# Altium project Thunderscope_Rev1.PrjPCB (part 2 of 2)

## Sheet CON_PCIe_X4.SchDoc: ThunderScope 1000E
size A4; DrawnBy: Aleksa Bjelogrlic; Revision: 1
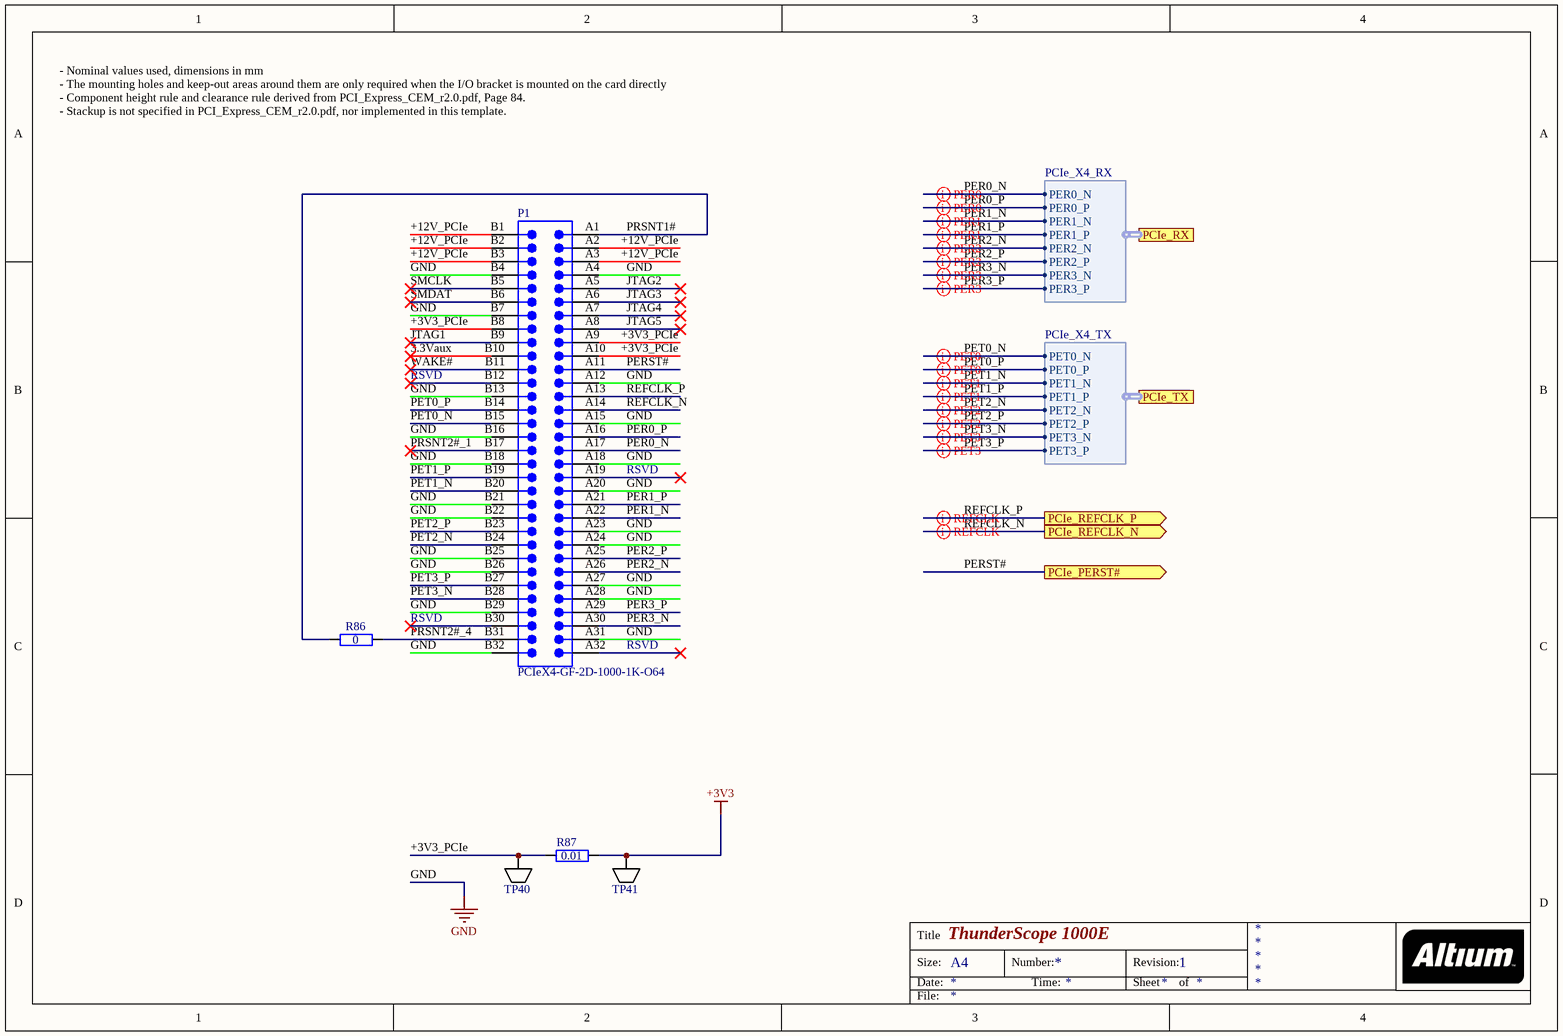
[diagram p6: CON_PCIe_X4.SchDoc]

### Parts
P1  PCIeX4-GF-2D-1000-1K-O64  [PCIeX4-GF-2D-1000-1K-O64]  (no BOM)
R86  0  [GEN_R_0402]
R87  0.01  [GEN_R_0603]
TP40  5015  [KEY_5015]  (value not drawn)
TP41  5015  [KEY_5015]  (value not drawn)

### Ports
PCIe_PERST# (out), PCIe_REFCLK_N (out), PCIe_REFCLK_P (out), PCIe_RX (harness PCIe_X4_RX), PCIe_TX (harness PCIe_X4_TX)

### Harnesses
PCIe_X4_RX: PER0_N, PER0_P, PER1_N, PER1_P, PER2_N, PER2_P, PER3_N, PER3_P
PCIe_X4_TX: PET0_N, PET0_P, PET1_N, PET1_P, PET2_N, PET2_P, PET3_N, PET3_P

### Nets
+3V3: R87.2 TP41.1
GND: P1.A4 P1.A12 P1.A15 P1.A18 P1.A20 P1.A23 P1.A24 P1.A27 P1.A28 P1.A31 P1.B4 P1.B7 P1.B13 P1.B16 P1.B18 P1.B21 P1.B22 P1.B25 P1.B26 P1.B29 P1.B32
3.3Vaux: P1.B10
+3V3_PCIe: P1.A9 P1.A10 P1.B8 R87.1 TP40.1
+12V_PCIe: P1.A2 P1.A3 P1.B1 P1.B2 P1.B3
JTAG1: P1.B9
JTAG2: P1.A5
JTAG3: P1.A6
JTAG4: P1.A7
JTAG5: P1.A8
PER0_N: P1.A17 ; port PCIe_RX.PER0_N  [project net PCIe_PER0_N]
PER0_P: P1.A16 ; port PCIe_RX.PER0_P  [project net PCIe_PER0_P]
PER1_N: P1.A22 ; port PCIe_RX.PER1_N  [project net PCIe_PER1_N]
PER1_P: P1.A21 ; port PCIe_RX.PER1_P  [project net PCIe_PER1_P]
PER2_N: P1.A26 ; port PCIe_RX.PER2_N  [project net PCIe_PER2_N]
PER2_P: P1.A25 ; port PCIe_RX.PER2_P  [project net PCIe_PER2_P]
PER3_N: P1.A30 ; port PCIe_RX.PER3_N  [project net PCIe_PER3_N]
PER3_P: P1.A29 ; port PCIe_RX.PER3_P  [project net PCIe_PER3_P]
PERST#: P1.A11 ; port PCIe_PERST#  [project net PCIe_PERST#]
PET0_N: P1.B15 ; port PCIe_TX.PET0_N  [project net PCIe_PET0_N]
PET0_P: P1.B14 ; port PCIe_TX.PET0_P  [project net PCIe_PET0_P]
PET1_N: P1.B20 ; port PCIe_TX.PET1_N  [project net PCIe_PET1_N]
PET1_P: P1.B19 ; port PCIe_TX.PET1_P  [project net PCIe_PET1_P]
PET2_N: P1.B24 ; port PCIe_TX.PET2_N  [project net PCIe_PET2_N]
PET2_P: P1.B23 ; port PCIe_TX.PET2_P  [project net PCIe_PET2_P]
PET3_N: P1.B28 ; port PCIe_TX.PET3_N  [project net PCIe_PET3_N]
PET3_P: P1.B27 ; port PCIe_TX.PET3_P  [project net PCIe_PET3_P]
PRSNT1#: P1.A1 R86.1
PRSNT2#_1: P1.B17
PRSNT2#_4: P1.B31 R86.2
REFCLK_N: P1.A14 ; port PCIe_REFCLK_N  [project net PCIe_REFCLK_N]
REFCLK_P: P1.A13 ; port PCIe_REFCLK_P  [project net PCIe_REFCLK_P]
SMCLK: P1.B5
SMDAT: P1.B6
WAKE#: P1.B11

Not connected (* = marked no-connect by the designer): P1 A19* A32* B12* B30*

### Layout directives
differential pair: PCIe_PER0_N, PCIe_PER0_P, PCIe_PER1_N, PCIe_PER1_P, PCIe_PER2_N, PCIe_PER2_P, PCIe_PER3_N, PCIe_PER3_P, PCIe_PET0_N, PCIe_PET0_P, PCIe_PET1_N, PCIe_PET1_P, PCIe_PET2_N, PCIe_PET2_P, PCIe_PET3_N, PCIe_PET3_P, PCIe_REFCLK_N, PCIe_REFCLK_P

### Notes on the sheet
- - Nominal values used, dimensions in mm
  - The mounting holes and keep-out areas around them are only required when the I/O bracket is mounted on the card directly
  - Component height rule and clearance rule derived from PCI_Express_CEM_r2.0.pdf, Page 84.
  - Stackup is not specified in PCI_Express_CEM_r2.0.pdf, nor implemented in this template.
- RSVD
- (near R86) RSVD
- Title
- Size:
- Date:
- A4
- Number:
- Time:
- Revision:
- Sheet
- of
- File:

### Library data of the parts
P1 = CMP-0001-00031-2: Golden finger, PCIeX4, Dual, Opposite, Pitch 1mm, 64-Position; Mating Connector: Molex-87715-9106; Datasheet Version: rev2.0, Apr-2007; Package Reference: PCIeX4-GF-2D-1000-1K-O64; ClassName: Edge Connector; Publisher: Altium
R86 = RES 0 OHM 1/16W 0402: Power Rating: 0.0625W; Package: 0402; Supplier 1: Digi-Key; Supplier Part Number 1: 311-0.0JRCT-ND; Value: 0
R87 = RES 0.01 OHM 1% 1/4W 0603: Tolerance: 1%; Power Rating: 0.25W; Supplier 1: Digi-Key; Supplier Part Number 1: 408-1404-1-ND; Value: 0.01; Package: 0603
TP40 TP41 = TP KEYSTONE 5015: Supplier 1: Digi-Key; Supplier Part Number 1: 36-5015CT-ND

## Sheet M2_KEY_M.SchDoc: ThunderScope 1000E
size A4
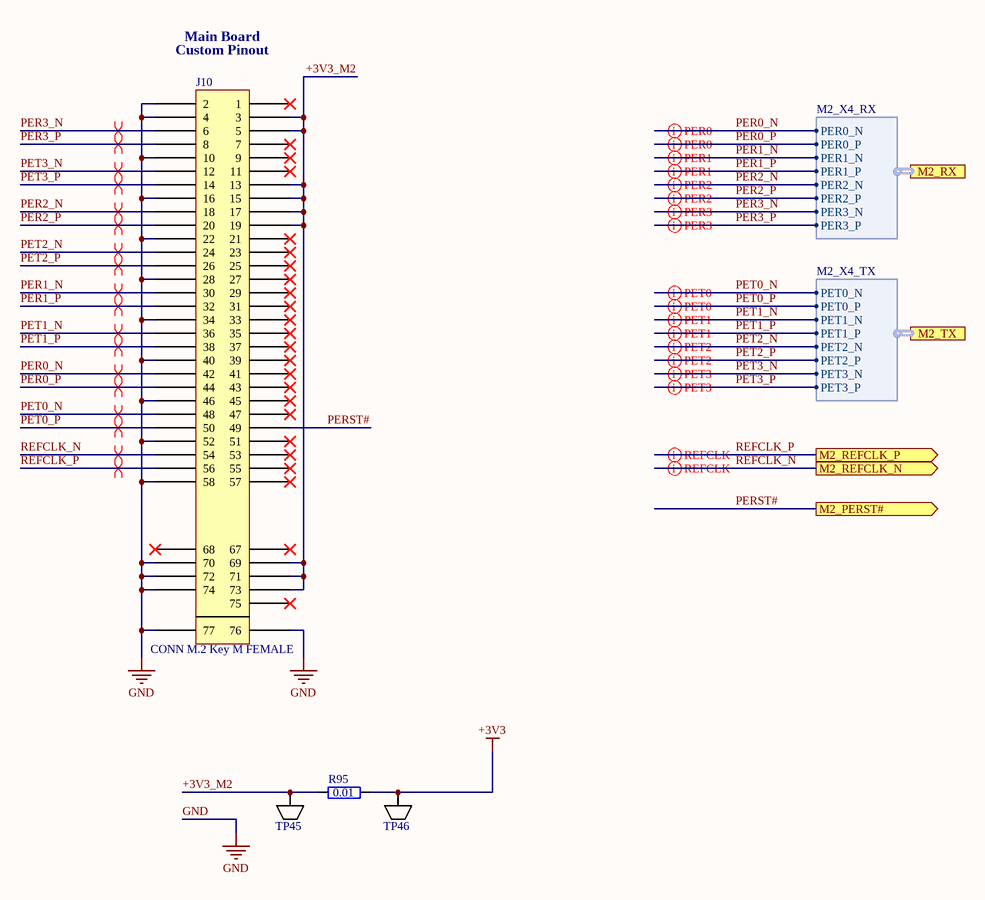
[diagram p7: M2_KEY_M.SchDoc]

### Parts
J10  CONN M.2 Key M FEMALE  [TE_M2_KEYM_2199230]
R95  0.01  [GEN_R_0603]
TP45  5015  [KEY_5015]  (value not drawn)
TP46  5015  [KEY_5015]  (value not drawn)

### Ports
M2_PERST# (out), M2_REFCLK_N (out), M2_REFCLK_P (out), M2_RX (harness M2_X4_RX), M2_TX (harness M2_X4_TX)

### Harnesses
M2_X4_RX: PER0_N, PER0_P, PER1_N, PER1_P, PER2_N, PER2_P, PER3_N, PER3_P
M2_X4_TX: PET0_N, PET0_P, PET1_N, PET1_P, PET2_N, PET2_P, PET3_N, PET3_P

### Nets
+3V3: R95.2 TP46.1
GND: J10.2 J10.4 J10.10 J10.16 J10.22 J10.28 J10.34 J10.40 J10.46 J10.52 J10.58 J10.70 J10.72 J10.74 J10.76 J10.77
+3V3_M2: J10.3 J10.5 J10.13 J10.15 J10.17 J10.19 J10.69 J10.71 J10.73 R95.1 TP45.1
PER0_N: J10.42 ; port M2_RX.PER0_N  [project net M2_PER0_N]
PER0_P: J10.44 ; port M2_RX.PER0_P  [project net M2_PER0_P]
PER1_N: J10.30 ; port M2_RX.PER1_N  [project net M2_PER1_N]
PER1_P: J10.32 ; port M2_RX.PER1_P  [project net M2_PER1_P]
PER2_N: J10.18 ; port M2_RX.PER2_N  [project net M2_PER2_N]
PER2_P: J10.20 ; port M2_RX.PER2_P  [project net M2_PER2_P]
PER3_N: J10.6 ; port M2_RX.PER3_N  [project net M2_PER3_N]
PER3_P: J10.8 ; port M2_RX.PER3_P  [project net M2_PER3_P]
PERST#: J10.49 ; port M2_PERST#  [project net M2_PERST#]
PET0_N: J10.48 ; port M2_TX.PET0_N  [project net M2_PET0_N]
PET0_P: J10.50 ; port M2_TX.PET0_P  [project net M2_PET0_P]
PET1_N: J10.36 ; port M2_TX.PET1_N  [project net M2_PET1_N]
PET1_P: J10.38 ; port M2_TX.PET1_P  [project net M2_PET1_P]
PET2_N: J10.24 ; port M2_TX.PET2_N  [project net M2_PET2_N]
PET2_P: J10.26 ; port M2_TX.PET2_P  [project net M2_PET2_P]
PET3_N: J10.12 ; port M2_TX.PET3_N  [project net M2_PET3_N]
PET3_P: J10.14 ; port M2_TX.PET3_P  [project net M2_PET3_P]
REFCLK_N: J10.54 ; port M2_REFCLK_N  [project net M2_REFCLK_N]
REFCLK_P: J10.56 ; port M2_REFCLK_P  [project net M2_REFCLK_P]

Not connected (* = marked no-connect by the designer): J10 1* 7* 9* 11* 21* 23* 25* 27* 29* 31* 33* 35* 37* 39* 41* 43* 45* 47* 51* 53* 55* 57* 67* 68* 75*

### Layout directives
differential pair: M2_PER0_N, M2_PER0_P, M2_PER1_N, M2_PER1_P, M2_PER2_N, M2_PER2_P, M2_PER3_N, M2_PER3_P, M2_PET0_N, M2_PET0_P, M2_PET1_N, M2_PET1_P, M2_PET2_N, M2_PET2_P, M2_PET3_N, M2_PET3_P, M2_REFCLK_N, M2_REFCLK_P
differential pair; differential pair class PCIe: M2_PER0_N, M2_PER0_P, M2_PER1_N, M2_PER1_P, M2_PER2_N, M2_PER2_P, M2_PER3_N, M2_PER3_P, M2_PET0_N, M2_PET0_P, M2_PET1_N, M2_PET1_P, M2_PET2_N, M2_PET2_P, M2_PET3_N, M2_PET3_P, M2_REFCLK_N, M2_REFCLK_P

### Notes on the sheet
- Main Board
- (near J10) Custom Pinout

### Library data of the parts
R95 = RES 0.01 OHM 1% 1/4W 0603: Tolerance: 1%; Power Rating: 0.25W; Supplier 1: Digi-Key; Supplier Part Number 1: 408-1404-1-ND; Value: 0.01; Package: 0603
TP45 TP46 = TP KEYSTONE 5015: Supplier 1: Digi-Key; Supplier Part Number 1: 36-5015CT-ND
J10 = CONN M.2 Key M FEMALE: Supplier 1: Digi-Key; Supplier Part Number 1: A124992CT-ND

## Nets that join several sheets
+1V8APLL: ADC (FB3.2), PLL (17 pins)
+1V8DPLL: ADC (FB4.2), PLL (C90.1 U15.29)
+3V3: Main (C1.1 R5.2 TP8.1 U1.5), FE (Q1.2 Q2.2 R20.2 R21.2), Front End/CH1 (7 pins), Front End/CH2 (7 pins), Front End/CH3 (7 pins), Front End/CH4 (7 pins), ADC (9 pins), PLL (6 pins), FPGA (14 pins), CON_PCIe_X4 (R87.2 TP41.1), M2_KEY_M (R95.2 TP46.1)
+4V8: FE (13 pins), Front End/CH1 (17 pins), Front End/CH2 (17 pins), Front End/CH3 (17 pins), Front End/CH4 (17 pins)
+5V: Main (R4.2 TP4.1), FE (R7.1 R8.1 TP13.1 TP14.1)
-2V5_REF: FE (TP19.1 U5.2 U5.6), Front End/CH1 (C28A.1 R47A.1), Front End/CH2 (C28B.1 R47B.1), Front End/CH3 (C28C.1 R47C.1), Front End/CH4 (C28D.1 R47D.1)
-4V8: FE (5 pins), Front End/CH1 (13 pins), Front End/CH2 (13 pins), Front End/CH3 (13 pins), Front End/CH4 (13 pins)
GND: Main (12 pins), FE (17 pins), Front End/CH1 (48 pins), Front End/CH2 (48 pins), Front End/CH3 (48 pins), Front End/CH4 (48 pins), ADC (35 pins), PLL (26 pins), FPGA (54 pins), CON_PCIe_X4 (21 pins), M2_KEY_M (16 pins)
ACQ_EN: ADC (R38.2 TP33.1 U11.4), PLL (U14.3), FPGA (JM2.52)
ADC_CLK_N: ADC (C104.2 J5.1), PLL (U15.24)
ADC_CLK_P: ADC (C103.2 J6.1), PLL (U15.23)
ADC_CSn: ADC (R42.1 TP29.1 U12.2), FPGA (JM2.66)
ADC_SCLK: ADC (TP35.1 U12.4), FPGA (JM2.42)
ADC_SDATA: ADC (TP34.1 U12.3), FPGA (JM2.44)
ATTEN_1: Front End/CH1 (R27A.2 R28A.2 TP25A.1), FPGA (JM2.37)
ATTEN_2: Front End/CH2 (R27B.2 R28B.2 TP25B.1), FPGA (JM2.47)
ATTEN_3: Front End/CH3 (R27C.2 R28C.2 TP25C.1), FPGA (JM2.55)
ATTEN_4: Front End/CH4 (R27D.2 R28D.2 TP25D.1), FPGA (JM2.63)
CH1_N: Front End/CH1 (R40A.2), ADC (R57.2 U12.47)
CH1_P: Front End/CH1 (R30A.2), ADC (R57.1 U12.46)
CH2_N: Front End/CH2 (R40B.2), ADC (R60.2 U12.44)
CH2_P: Front End/CH2 (R30B.2), ADC (R60.1 U12.43)
CH3_N: Front End/CH3 (R40C.2), ADC (R62.2 U12.41)
CH3_P: Front End/CH3 (R30C.2), ADC (R62.1 U12.40)
CH4_N: Front End/CH4 (R40D.2), ADC (R63.2 U12.38)
CH4_P: Front End/CH4 (R30D.2), ADC (R63.1 U12.37)
D1A_N: ADC (U12.10), FPGA (JM1.57)
D1A_P: ADC (U12.9), FPGA (JM1.55)
D1B_N: ADC (U12.12), FPGA (JM1.61)
D1B_P: ADC (U12.11), FPGA (JM1.59)
D2A_N: ADC (U12.14), FPGA (JM1.67)
D2A_P: ADC (U12.13), FPGA (JM1.65)
D2B_N: ADC (U12.16), FPGA (JM1.71)
D2B_P: ADC (U12.15), FPGA (JM1.69)
D3A_N: ADC (U12.22), FPGA (JM1.81)
D3A_P: ADC (U12.21), FPGA (JM1.79)
D3B_N: ADC (U12.24), FPGA (JM1.87)
D3B_P: ADC (U12.23), FPGA (JM1.85)
D4A_N: ADC (U12.26), FPGA (JM1.95)
D4A_P: ADC (U12.25), FPGA (JM1.93)
D4B_N: ADC (U12.28), FPGA (JM1.99)
D4B_P: ADC (U12.27), FPGA (JM1.97)
DC_CPL_1: Front End/CH1 (TP22A.1 U10A.1), FPGA (JM2.41)
DC_CPL_2: Front End/CH2 (TP22B.1 U10B.1), FPGA (JM2.51)
DC_CPL_3: Front End/CH3 (TP22C.1 U10C.1), FPGA (JM2.57)
DC_CPL_4: Front End/CH4 (TP22D.1 U10D.1), FPGA (JM2.65)
FCLK_N: ADC (U12.20), FPGA (JM1.78)
FCLK_P: ADC (U12.19), FPGA (JM1.76)
FE_EN: Main (R6.1 U2.B3), FPGA (JM2.54)
LCLK_N: ADC (U12.18), FPGA (JM1.62)
LCLK_P: ADC (U12.17), FPGA (JM1.60)
M2_PER0_N: FPGA (C76.1), M2_KEY_M (J10.42)
M2_PER0_P: FPGA (C77.1), M2_KEY_M (J10.44)
M2_PER1_N: FPGA (C72.1), M2_KEY_M (J10.30)
M2_PER1_P: FPGA (C73.1), M2_KEY_M (J10.32)
M2_PER2_N: FPGA (C68.1), M2_KEY_M (J10.18)
M2_PER2_P: FPGA (C69.1), M2_KEY_M (J10.20)
M2_PER3_N: FPGA (C16.1), M2_KEY_M (J10.6)
M2_PER3_P: FPGA (C65.1), M2_KEY_M (J10.8)
M2_PERST#: FPGA (R85.2), M2_KEY_M (J10.49)
M2_PET0_N: FPGA (R82.2), M2_KEY_M (J10.48)
M2_PET0_P: FPGA (R83.2), M2_KEY_M (J10.50)
M2_PET1_N: FPGA (R78.2), M2_KEY_M (J10.36)
M2_PET1_P: FPGA (R79.2), M2_KEY_M (J10.38)
M2_PET2_N: FPGA (R74.2), M2_KEY_M (J10.24)
M2_PET2_P: FPGA (R75.2), M2_KEY_M (J10.26)
M2_PET3_N: FPGA (R70.2), M2_KEY_M (J10.12)
M2_PET3_P: FPGA (R71.2), M2_KEY_M (J10.14)
M2_REFCLK_N: FPGA (C80.1), M2_KEY_M (J10.54)
M2_REFCLK_P: FPGA (C81.1), M2_KEY_M (J10.56)
PCIe_PER0_N: FPGA (C74.1), CON_PCIe_X4 (P1.A17)
PCIe_PER0_P: FPGA (C75.1), CON_PCIe_X4 (P1.A16)
PCIe_PER1_N: FPGA (C70.1), CON_PCIe_X4 (P1.A22)
PCIe_PER1_P: FPGA (C71.1), CON_PCIe_X4 (P1.A21)
PCIe_PER2_N: FPGA (C66.1), CON_PCIe_X4 (P1.A26)
PCIe_PER2_P: FPGA (C67.1), CON_PCIe_X4 (P1.A25)
PCIe_PER3_N: FPGA (C62.1), CON_PCIe_X4 (P1.A30)
PCIe_PER3_P: FPGA (C15.1), CON_PCIe_X4 (P1.A29)
PCIe_PERST#: FPGA (R84.2), CON_PCIe_X4 (P1.A11)
PCIe_PET0_N: FPGA (R80.2), CON_PCIe_X4 (P1.B15)
PCIe_PET0_P: FPGA (R81.2), CON_PCIe_X4 (P1.B14)
PCIe_PET1_N: FPGA (R76.2), CON_PCIe_X4 (P1.B20)
PCIe_PET1_P: FPGA (R77.2), CON_PCIe_X4 (P1.B19)
PCIe_PET2_N: FPGA (R72.2), CON_PCIe_X4 (P1.B24)
PCIe_PET2_P: FPGA (R73.2), CON_PCIe_X4 (P1.B23)
PCIe_PET3_N: FPGA (R68.2), CON_PCIe_X4 (P1.B28)
PCIe_PET3_P: FPGA (R69.2), CON_PCIe_X4 (P1.B27)
PCIe_REFCLK_N: FPGA (C40.1), CON_PCIe_X4 (P1.A14)
PCIe_REFCLK_P: FPGA (C79.1), CON_PCIe_X4 (P1.A13)
PGA_CSn_1: Front End/CH1 (R29A.1 TP26A.1 U7A.9), FPGA (JM2.35)
PGA_CSn_2: Front End/CH2 (R29B.1 TP26B.1 U7B.9), FPGA (JM2.45)
PGA_CSn_3: Front End/CH3 (R29C.1 TP26C.1 U7C.9), FPGA (JM2.53)
PGA_CSn_4: Front End/CH4 (R29D.1 TP26D.1 U7D.9), FPGA (JM2.61)
PGA_SCLK: FE (TP17.1), Front End/CH1 (U7A.11), Front End/CH2 (U7B.11), Front End/CH3 (U7C.11), Front End/CH4 (U7D.11), FPGA (JM2.33)
PGA_SDIO: FE (TP18.1), Front End/CH1 (U7A.10), Front End/CH2 (U7B.10), Front End/CH3 (U7C.10), Front End/CH4 (U7D.10), FPGA (JM2.31)
PLL_RSTn: PLL (R89.1 TP44.1 U15.30), FPGA (JM2.48)
PROBE_COMP: Main (R2.2 U1.2), FPGA (JM2.43)
SCL: FE (Q1.3 R20.1), PLL (R90.1 TP43.1 U15.31), FPGA (JM2.58)
SDA: FE (Q2.3 R21.1), PLL (R91.1 TP42.1 U15.2), FPGA (JM2.56)
TRIM1: FE (R15.1), Front End/CH1 (5 pins)
TRIM2: FE (R17.1), Front End/CH2 (5 pins)
TRIM3: FE (R18.1), Front End/CH3 (5 pins)
TRIM4: FE (R19.1), Front End/CH4 (5 pins)
VCM: FE (TP16.1), Front End/CH1 (U7A.13), Front End/CH2 (U7B.13), Front End/CH3 (U7C.13), Front End/CH4 (U7D.13), ADC (U12.48)